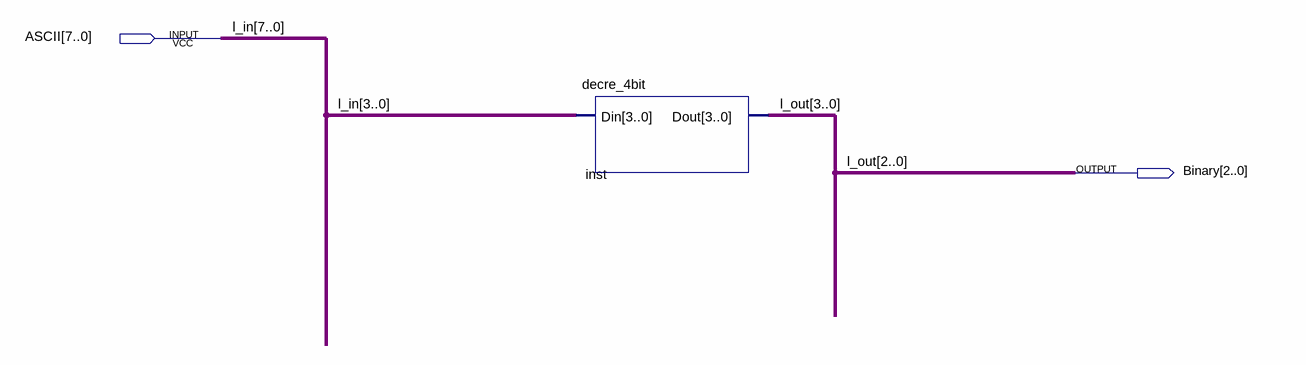
[diagram p0: schematic sheet]
// Quartus schematic ascii_to_address.bdf as structural Verilog: 1 symbols, 2 pins
module ascii_to_address (
  input  [7:0] ASCII,
  output [2:0] Binary
);

  wire [3:3] l_out;

  decre_4bit inst (.Din(ASCII[3:0]), .Dout({l_out[3], Binary}));

  // Other names for the same wires on the sheet: l_in[7:0] = ASCII; l_out[2:0] = Binary
endmodule
